# EAGLE schematic Z-Bus (EAGLE 9.5.2)
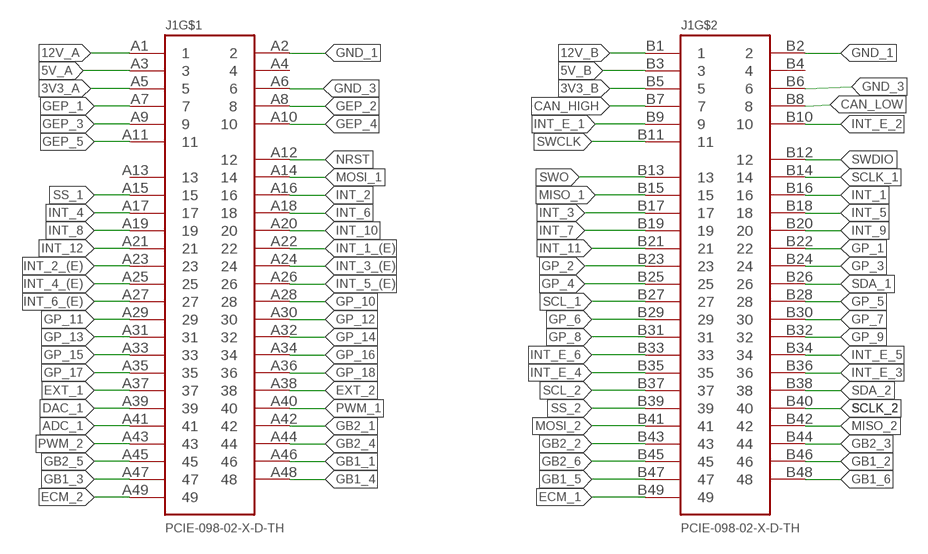
[diagram p0: schematic, sheet 1]

## Parts
J1  PCIE-098-02-X-D-TH  [PCIE-098-02-X-D-TH]

## Nets
3V3_A: J1.A5
3V3_B: J1.B5
5V_A: J1.A3
5V_B: J1.B3
12V_A: J1.A1
12V_B: J1.B1
ADC_1: J1.A41
CAN_HIGH: J1.B7
CAN_LOW: J1.B8
DAC_1: J1.A39
ECM_1: J1.B49
ECM_2: J1.A49
EXT_1: J1.A37
EXT_2: J1.A38
GB1_1: J1.A46
GB1_2: J1.B46
GB1_3: J1.A47
GB1_4: J1.A48
GB1_5: J1.B47
GB1_6: J1.B48
GB2_1: J1.A42
GB2_2: J1.B43
GB2_3: J1.B44
GB2_4: J1.A44
GB2_5: J1.A45
GB2_6: J1.B45
GEP_1: J1.A7
GEP_2: J1.A8
GEP_3: J1.A9
GEP_4: J1.A10
GEP_5: J1.A11
GND_1: J1.A2 J1.B2
GND_3: J1.A6 J1.B6
GP_1: J1.B22
GP_2: J1.B23
GP_3: J1.B24
GP_4: J1.B25
GP_5: J1.B28
GP_6: J1.B29
GP_7: J1.B30
GP_8: J1.B31
GP_9: J1.B32
GP_10: J1.A28
GP_11: J1.A29
GP_12: J1.A30
GP_13: J1.A31
GP_14: J1.A32
GP_15: J1.A33
GP_16: J1.A34
GP_17: J1.A35
GP_18: J1.A36
INT_1: J1.B16
INT_1_(E): J1.A22
INT_2: J1.A16
INT_2_(E): J1.A23
INT_3: J1.B17
INT_3_(E): J1.A24
INT_4: J1.A17
INT_4_(E): J1.A25
INT_5: J1.B18
INT_5_(E): J1.A26
INT_6: J1.A18
INT_6_(E): J1.A27
INT_7: J1.B19
INT_8: J1.A19
INT_9: J1.B20
INT_10: J1.A20
INT_11: J1.B21
INT_12: J1.A21
INT_E_1: J1.B9
INT_E_2: J1.B10
INT_E_3: J1.B36
INT_E_4: J1.B35
INT_E_5: J1.B34
INT_E_6: J1.B33
MISO_1: J1.B15
MISO_2: J1.B42
MOSI_1: J1.A14
MOSI_2: J1.B41
NRST: J1.A12
PWM_1: J1.A40
PWM_2: J1.A43
SCL_1: J1.B27
SCL_2: J1.B37
SCLK_1: J1.B14
SCLK_2: J1.B40
SDA_1: J1.B26
SDA_2: J1.B38
SS_1: J1.A15
SS_2: J1.B39
SWCLK: J1.B11
SWDIO: J1.B12
SWO: J1.B13
Unconnected: J1.A4 J1.A13 J1.B4

## Library data of the parts
J1 = Z_BUS:PCIE-098-02-X-D-TH: PCI EXPRESS CARD CONNECTOR ,98 PINS.; AVAILABILITY: Unavailable; DESCRIPTION: 98 Position Female Connector PCI Express™ Gold 0.039 _1.00mm_ Black; MF: Samtec; MP: PCIE-098-02-F-D-TH; PACKAGE: None; PRICE: None